# Altium schematic sheet Bluetooth.SchDoc
size A4
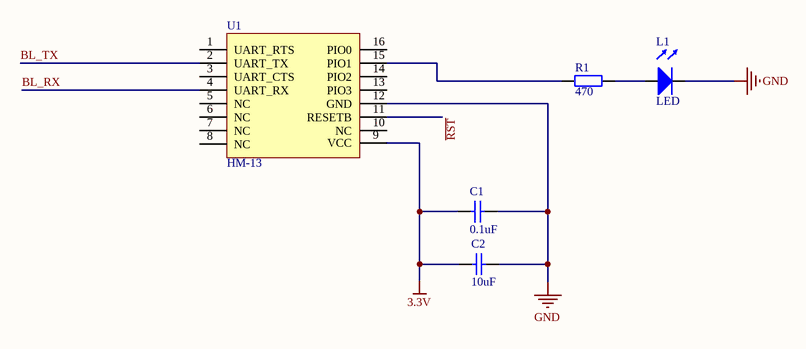
[diagram p0: Bluetooth.SchDoc]

## Parts
C1  0.1uF  [0603]
C2  10uF  [0603]
L1  LED  [0805]
R1  470  [0603]
U1  HM-13  [HM-13]

## Nets
3.3V: C1.2 C2.2 U1.9(VCC)
GND: C1.1 C2.1 L1.2(K) U1.12(GND)
BL_RX: U1.4(UART_RX)
BL_TX: U1.2(UART_TX)
~{RST}: U1.11(RESETB)
NetL1_1: L1.1(A) R1.2
NetR1_1: R1.1 U1.15(PIO1)

Not connected (* = marked no-connect by the designer): U1 1(UART_RTS) 3(UART_CTS) 5(NC) 6(NC) 7(NC) 8(NC) 10(NC) 13(PIO3) 14(PIO2) 16(PIO0)

## Library data of the parts
C1 C2 = Cap1: ceramic
R1 = Res